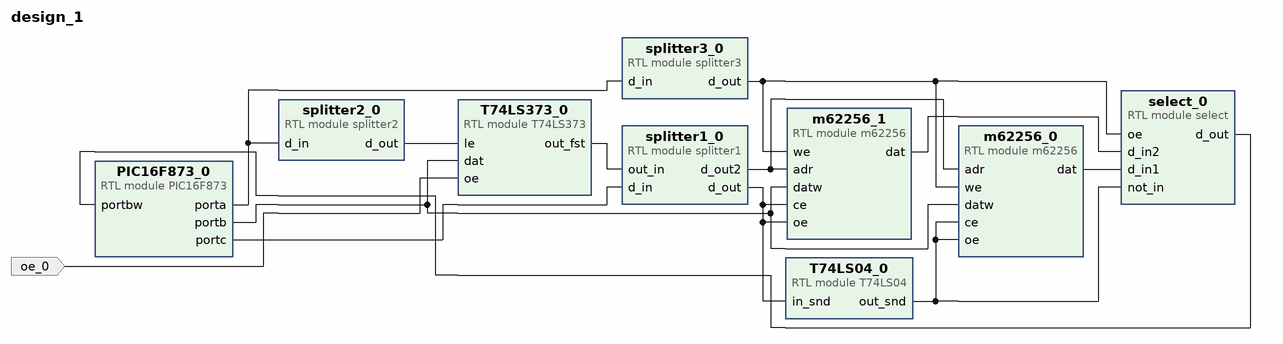
[diagram p0: block diagram of the top level]
# Vivado block design design_1, xc7a100tcsg324-1, Vivado 2019.1
create_bd_design design_1

create_bd_port -dir I oe_0

create_bd_cell -type module -reference splitter1 splitter1_0
create_bd_cell -type module -reference splitter2 splitter2_0
create_bd_cell -type module -reference splitter3 splitter3_0
create_bd_cell -type module -reference select select_0
create_bd_cell -type module -reference PIC16F873 PIC16F873_0
create_bd_cell -type module -reference T74LS04 T74LS04_0
create_bd_cell -type module -reference T74LS373 T74LS373_0
create_bd_cell -type module -reference m62256 m62256_0
create_bd_cell -type module -reference m62256 m62256_1

# ---- connections ----

connect_bd_net -net oe_0_1 [get_bd_ports oe_0] [get_bd_pins T74LS373_0/oe]
connect_bd_net [get_bd_pins splitter2_0/d_out] [get_bd_pins T74LS373_0/le]
connect_bd_net [get_bd_pins PIC16F873_0/porta] [get_bd_pins splitter2_0/d_in] [get_bd_pins splitter3_0/d_in]
connect_bd_net [get_bd_pins select_0/d_out] [get_bd_pins PIC16F873_0/portbw]
connect_bd_net [get_bd_pins m62256_1/dat] [get_bd_pins select_0/d_in2]
connect_bd_net [get_bd_pins m62256_0/dat] [get_bd_pins select_0/d_in1]
connect_bd_net [get_bd_pins splitter3_0/d_out] [get_bd_pins select_0/oe] [get_bd_pins m62256_0/we] [get_bd_pins m62256_1/we]
connect_bd_net [get_bd_pins PIC16F873_0/portb] [get_bd_pins T74LS373_0/dat] [get_bd_pins m62256_0/datw] [get_bd_pins m62256_1/datw]
connect_bd_net [get_bd_pins splitter1_0/d_out2] [get_bd_pins m62256_0/adr] [get_bd_pins m62256_1/adr]
connect_bd_net [get_bd_pins PIC16F873_0/portc] [get_bd_pins splitter1_0/d_in]
connect_bd_net [get_bd_pins T74LS373_0/out_fst] [get_bd_pins splitter1_0/out_in]
connect_bd_net [get_bd_pins splitter1_0/d_out] [get_bd_pins T74LS04_0/in_snd] [get_bd_pins m62256_1/ce] [get_bd_pins m62256_1/oe]
connect_bd_net [get_bd_pins T74LS04_0/out_snd] [get_bd_pins m62256_0/ce] [get_bd_pins m62256_0/oe] [get_bd_pins select_0/not_in]

validate_bd_design
save_bd_design
